# EAGLE design blast (EAGLE 6.5.0)
AUTHOR: Brad Campbell; REV: A; TITLE: Blast
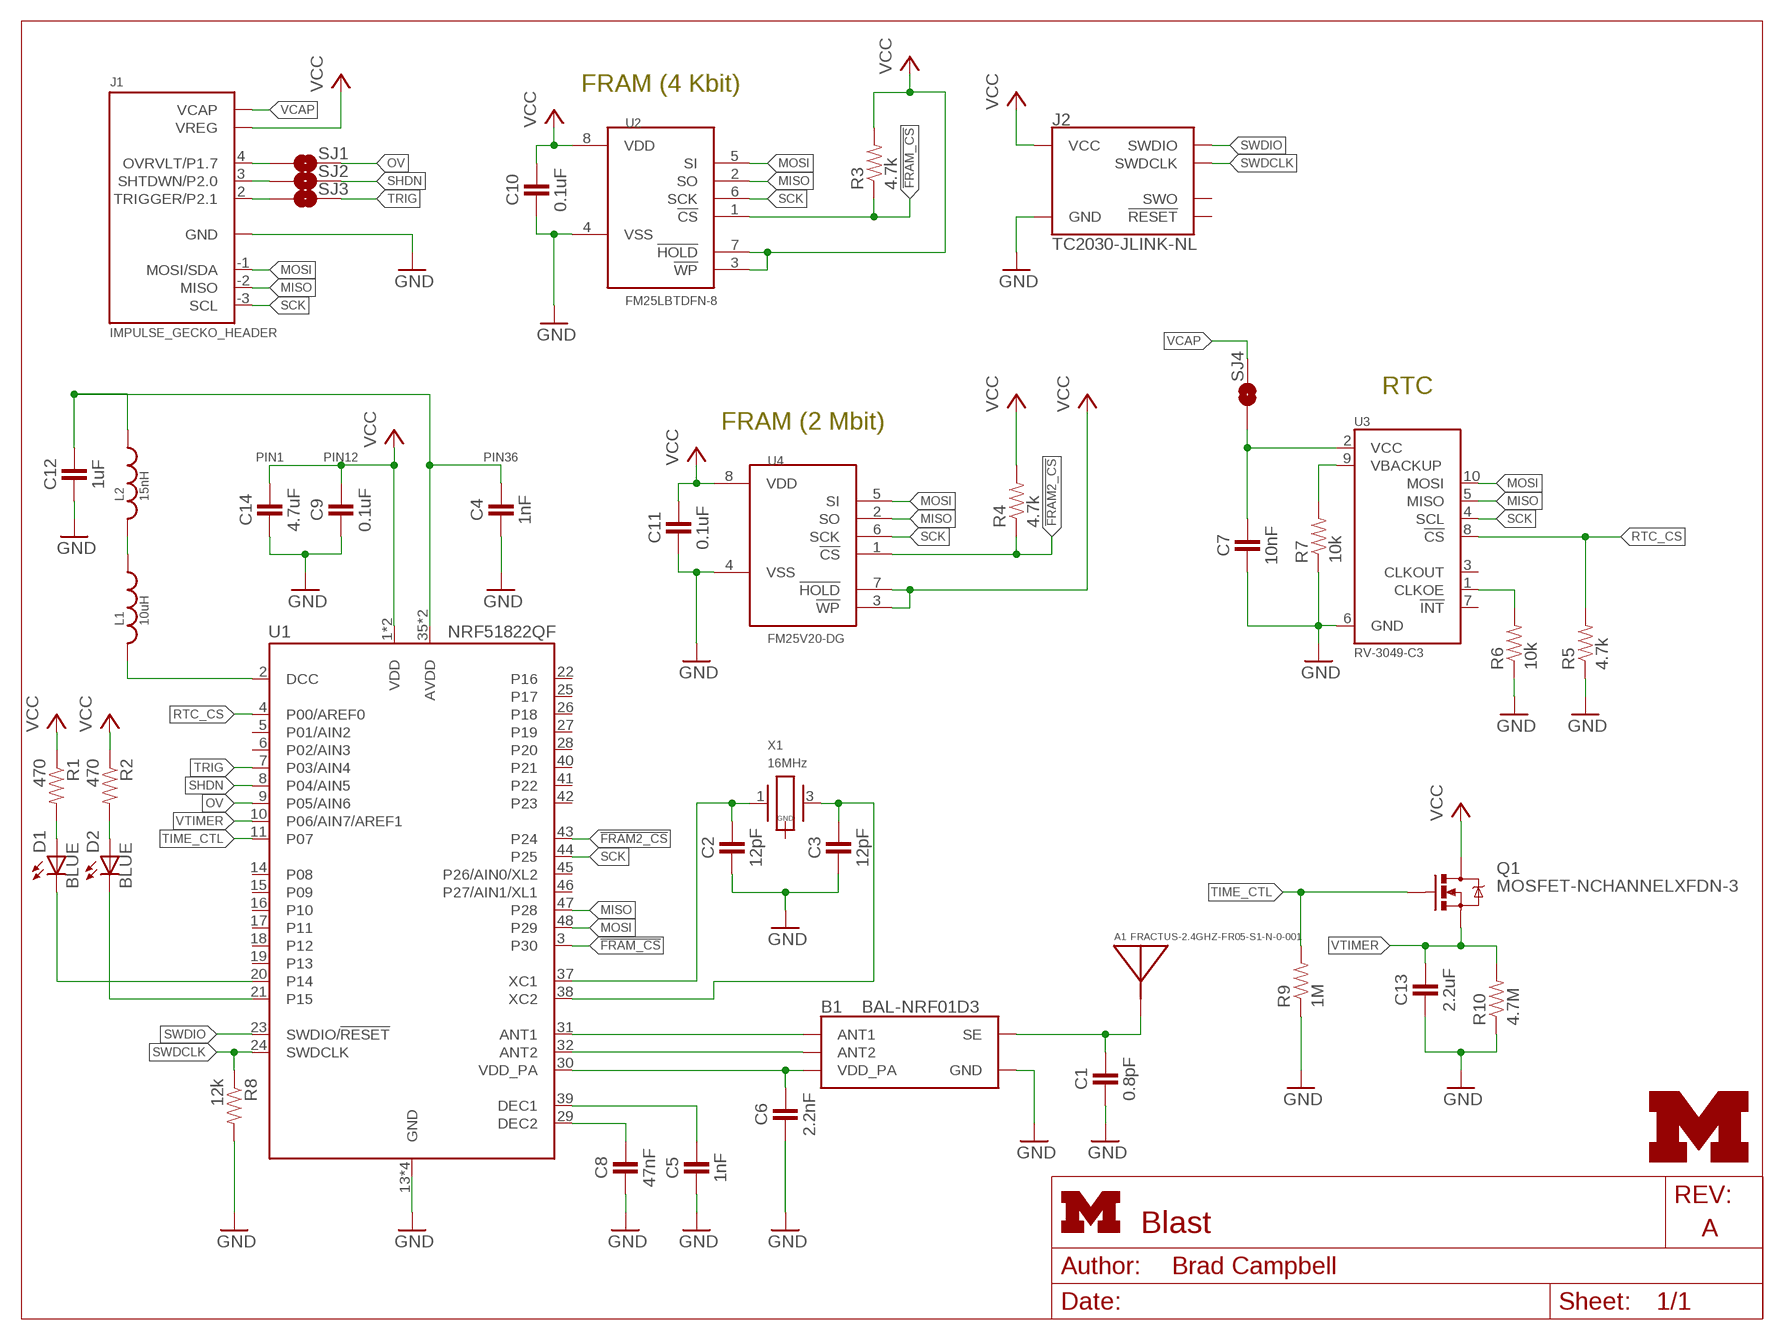
[diagram p0: schematic, sheet 1]
FRAME1 (LETTER_L): HEIGHT: 8.5in; WIDTH: 11in

## Parts
A1  FRACTUS-2.4GHZ-FR05-S1-N-0-001  [FRACTUS-ANTENNA-FR05-S1-N-0-001]
B1  BAL-NRF01D3  [BAL-NRF01D3]
C1  0.8pF  CAPACITOR  [0402_CAP]
C2  12pF  CAPACITOR  [0402_CAP]
C3  12pF  CAPACITOR  [0402_CAP]
C4  1nF  CAPACITOR  [0402_CAP]
C5  1nF  CAPACITOR  [0402_CAP]
C6  2.2nF  CAPACITOR  [0402_CAP]
C7  10nF  CAPACITOR  [0402_CAP]
C8  47nF  CAPACITOR  [0402_CAP]
C9  0.1uF  CAPACITOR  [0402_CAP]
C10  0.1uF  CAPACITOR  [0402_CAP]
C11  0.1uF  CAPACITOR  [0402_CAP]
C12  1uF  CAPACITOR  [0402_CAP]
C13  2.2uF  CAPACITOR  [0402_CAP]
C14  4.7uF  CAPACITOR  [0402_CAP]
D1  BLUE  LED0603  [LED-0603]
D2  BLUE  LED0603  [LED-0603]
J1  IMPULSE_GECKO_HEADER  [HEADER1X9/0.05IN]
J2  TC2030-JLINK-NL  [TC2030-IDC-NL]
L1  10uH  INDUCTOR0603  [0603_CAP]
L2  15nH  INDUCTOR0402  [0402_CAP]
Q1  MOSFET-NCHANNELXFDN-3  [XFDFN-3]
R1  470  RESISTOR  [0402_RES]
R2  470  RESISTOR  [0402_RES]
R3  4.7k  RESISTOR  [0402_RES]
R4  4.7k  RESISTOR  [0402_RES]
R5  4.7k  RESISTOR  [0402_RES]
R6  10k  RESISTOR  [0402_RES]
R7  10k  RESISTOR  [0402_RES]
R8  12k  RESISTOR  [0402_RES]
R9  1M  RESISTOR  [0402_RES]
R10  4.7M  RESISTOR  [0402_RES]
SJ1  SOLDERJUMPERNO  [SJ_2S-NO]
SJ2  SOLDERJUMPERNO  [SJ_2S-NO]
SJ3  SOLDERJUMPERNO  [SJ_2S-NO]
SJ4  SOLDERJUMPERNO  [SJ_2S-NO]
U1  NRF51822QF  [QFN-48-6MM]
U2  FM25LBTDFN-8  [TDFN-8@1]
U3  RV-3049-C3  [MICRO-CRYSTAL-C3]
U4  FM25V20-DG  [TDFN-8/6MM]
U$1  UMICH_SOLID_SMALL  [UMICH_SOLID_75MIL]
X1  16MHz  TXC-8Y  [TXC-8Y]

## Nets
!FRAM2_CS: R4.1 U1.43(P24) U4.1(!CS)
!FRAM_CS: R3.1 U1.3(P30) U2.1(!CS)
BATTERY: C7.1 SJ4.1 U3.2(VCC)
GND: B1.GND C1.2 C2.2 C3.2 C4.2 C5.2 C6.2 C7.2 C8.2 C9.2 C10.2 C11.2 C12.2 C13.2 C14.2 J1.0(GND) J2.5(GND) R5.1 R6.1 R7.1 R8.2 R9.1 R10.1 U1.13(GND) U1.33(GND) U1.34(GND) U1.GND U2.4(VSS) U3.6(GND) U4.4(VSS)
MISO: J1.-2(MISO) U1.47(P28) U2.2(SO) U3.5(MISO) U4.2(SO)
MOSI: J1.-1(MOSI/SDA) U1.48(P29) U2.5(SI) U3.10(MOSI) U4.5(SI)
N$1: D2.C U1.21(P15)
N$5: B1.ANT1 U1.31(ANT1)
N$6: B1.ANT2 U1.32(ANT2)
N$7: D1.C U1.20(P14)
N$8: R7.2 U3.9(VBACKUP)
N$9: R6.2 U3.1(CLKOE)
N$11: A1.1(ANTENNA) B1.SE C1.1
N$12: C4.1 C12.1 L2.1 U1.35(AVDD) U1.36(AVDD)
N$13: L1.2 U1.2(DCC)
N$14: L1.1 L2.2
N$15: D2.A R2.2
N$16: C2.1 U1.37(XC1) X1.1
N$17: C3.1 U1.38(XC2) X1.3
N$18: C5.1 U1.39(DEC1)
N$19: C8.1 U1.29(DEC2)
N$20: J1.2(TRIGGER/P2.1) SJ3.1
N$21: J1.3(SHTDWN/P2.0) SJ2.1
N$22: J1.4(OVRVLT/P1.7) SJ1.1
N$23: D1.A R1.2
OV: SJ1.2 U1.9(P05/AIN6)
RTC_CS: R5.2 U1.4(P00/AREF0) U3.8(!CS)
SCK: J1.-3(SCL) U1.44(P25) U2.6(SCK) U3.4(SCL) U4.6(SCK)
SHDN: SJ2.2 U1.8(P04/AIN5)
SWDCLK: J2.4(SWDCLK) R8.1 U1.24(SWDCLK)
SWDIO: J2.2(SWDIO) U1.23(SWDIO/!RESET)
TIME_CTL: Q1.G R9.2 U1.11(P07)
TRIG: SJ3.2 U1.7(P03/AIN4)
VCAP: J1.5(VCAP) SJ4.2
VCC: C9.1 C10.1 C11.1 C14.1 J1.1(VREG) J2.1(VCC) Q1.D R1.1 R2.1 R3.2 R4.2 U1.1(VDD) U1.12(VDD) U2.3(!WP) U2.7(!HOLD) U2.8(VDD) U4.3(!WP) U4.7(!HOLD) U4.8(VDD)
VDD_PA: B1.VCC(VDD_PA) C6.1 U1.30(VDD_PA)
VTIMER: C13.1 Q1.S R10.2 U1.10(P06/AIN7/AREF1)
Unconnected: J2.3(!RESET) J2.6(SWO) U1.5(P01/AIN2) U1.6(P02/AIN3) U1.14(P08) U1.15(P09) U1.16(P10) U1.17(P11) U1.18(P12) U1.19(P13) U1.22(P16) U1.25(P17) U1.26(P18) U1.27(P19) U1.28(P20) U1.40(P21) U1.41(P22) U1.42(P23) U1.45(P26/AIN0/XL2) U1.46(P27/AIN1/XL1) U3.3(CLKOUT) U3.7(!INT) X1.2(GND) X1.4(GND)

## Notes on the sheet
- FRAM (4 Kbit)
- RTC
- FRAM (2 Mbit)
- PIN1 | PIN12 | PIN36

## Library data of the parts
A1 = chips:FRACTUS-2.4GHZ-FR05-S1-N-0-001: Fractus Reach Xtend Bluetooth®, Zigbee®, 802.11 b/g/n WLAN Chip Antenna; RICHARDSON_RFPD: FR05-S1-N-0001B
B1 = chips:BAL-NRF01D3: 50 ohm nominal input / conjugate match balun to nRF51422-QFAA, nRF24LE1, nRF51822-QFAA/AB, with integrated harmonic filter; DIGIKEY: 497-13637-1-ND; MOUSER: 511-BAL-NRF01D3
C1 = passives:CAPACITOR: 0402 Capacitor; DIGIKEY: 490-6269-1-ND
C2 C3 = passives:CAPACITOR: 0402 Capacitor; DIGIKEY: 490-6197-1-ND
C4 C5 = passives:CAPACITOR: 0402 Capacitor; DIGIKEY: 490-1303-1-ND
C6 = passives:CAPACITOR: 0402 Capacitor; DIGIKEY: 490-5419-1-ND
C7 = passives:CAPACITOR: 0402 Capacitor; DIGIKEY: 445-1260-1-ND
C8 = passives:CAPACITOR: 0402 Capacitor; DIGIKEY: 445-1264-1-ND
C9-C11 = passives:CAPACITOR: 0402 Capacitor; DIGIKEY: 445-4952-1-ND
C12 = passives:CAPACITOR: 0402 Capacitor; DIGIKEY: 1276-1513-1-ND
C13 = passives:CAPACITOR: 0402 Capacitor; DIGIKEY: 445-3882-1-ND
C14 = passives:CAPACITOR: 0402 Capacitor; DIGIKEY: 445-5947-1-ND
D1 D2 = SparkFun-LED:LED: LEDs Standard schematic elements and footprints for 5mm, 3mm, 1206, and 0603 sized LEDs. 5mm - Spark Fun Electronics SKU : COM-00529 (and others); DIGIKEY: 160-1837-1-ND
J1 = gecko:IMPULSE_GECKO_HEADER: Header on the impulse EPIC-esque board.
J2 = connector:TC2030-JLINK
L1 = passives:INDUCTOR; DIGIKEY: 490-4025-1-ND
L2 = passives:INDUCTOR; DIGIKEY: 587-1521-1-ND
Q1 = fets:MOSFET-NCHANNEL: Generic NMOS footprint; DIGIKEY: DMN2400UFB4-7DICT-ND
R1 R2 = passives:RESISTOR: Resistor Basic schematic elements and footprints for 0603, 1206, and PTH resistors.; DIGIKEY: RHM470CECT-ND
R3-R5 = passives:RESISTOR: Resistor Basic schematic elements and footprints for 0603, 1206, and PTH resistors.; DIGIKEY: RHM4.7KCECT-ND
R6 R7 = passives:RESISTOR: Resistor Basic schematic elements and footprints for 0603, 1206, and PTH resistors.; DIGIKEY: RHM10KCECT-ND
R8 = passives:RESISTOR: Resistor Basic schematic elements and footprints for 0603, 1206, and PTH resistors.; DIGIKEY: RHM12.0KCDCT-ND
R9 = passives:RESISTOR: Resistor Basic schematic elements and footprints for 0603, 1206, and PTH resistors.; DIGIKEY: RHM1.0MCECT-ND
R10 = passives:RESISTOR: Resistor Basic schematic elements and footprints for 0603, 1206, and PTH resistors.; DIGIKEY: 541-4.7MJCT-ND
SJ1-SJ4 = SparkFun-Passives:SOLDERJUMPER: Solder Jumper Standard SMD solder jumper. Used to automate production. Two varients : Normally Open and Normally Closed are the same, but have different paste layers. NC will have a large amount of paste and should jumper during reflow.
U1 = chips:NRF51822: Multiprotocol Bluetooth® 4.0 low energy/2.4 GHz RF SoC; DIGIKEY: 1490-1042-1-ND; MOUSER: 949-NRF51822-QFAC-R7
U2 = chips:FM25LB: IC FRAM 4KBIT 10MHZ 8SOIC; DIGIKEY: FM25L04B-DGRA-ND; MOUSER: 877-FM25L04B-DG
U3 = chips:RV-3049-C3: The RV-3049-C3 is an ultra miniature Real-Time-Clock Module with embedded Crystal. This RTC has an SPI Bus (4-wire Serial- Interface) and offers temperature compensated time.; NEWARK: RV-3049-C3
U4 = chips:FM25: Cypress FRAM; DIGIKEY: FM25V20-DGRA-ND; MOUSER: 877-FM25V20-DG
U$1 = logos:UMICH_SOLID
X1 = crystals:TXC-8Y: 2mmx1.6mm SMD Crystal; DIGIKEY: 887-2003-1-ND

## Board
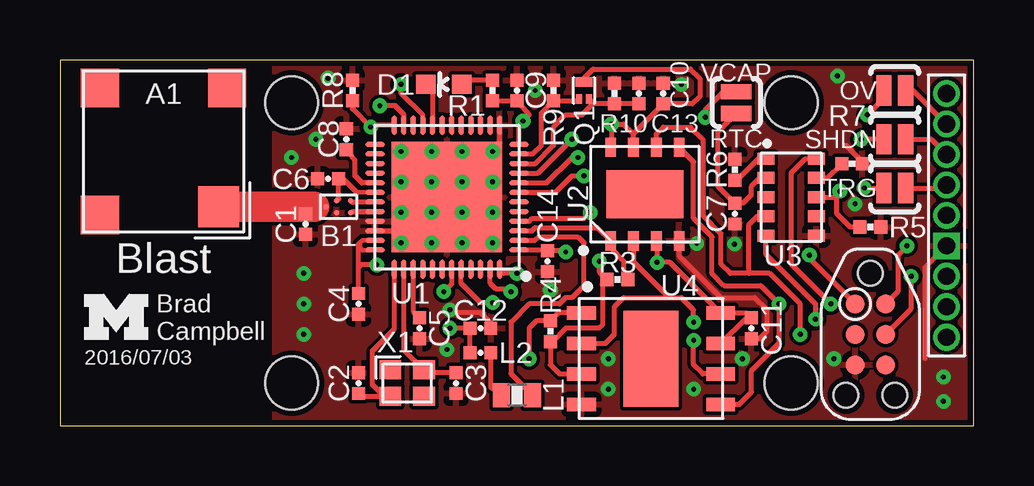
[diagram p1: board, top side]
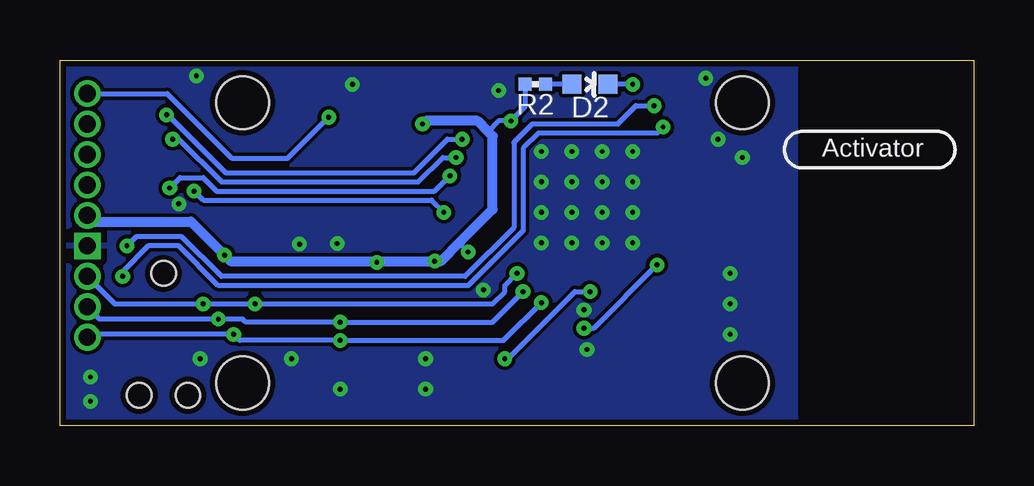
[diagram p2: board, bottom side, seen from below]

Size 38.1 x 15.24 mm. Coordinates in mm from the lower left corner, seen from the top.
Outline: 0,0 38.1,0 38.1,15.24 0,15.24 0,0
Copper layers (1*16): Top 0.0178mm / dielectric 59mil / Bottom 0.0178mm
Design rules "sunstone-2lyr_v1.0.0.3 *": minimum track width 6mil, minimum drill 8mil, track to track 6mil, track to pad 6mil, pad to pad 6mil, via to via 6mil, smd to smd 6mil, copper to edge 10mil, drill to drill 16mil, minimum pad ring 8mil, minimum via ring 8mil, stop-mask expansion 3mil, vias tented up to drill 50mil, thermal gap 10mil
Holes 2.2 mm at 9.65,13.46 30.48,1.78 9.65,1.78 30.48,13.46

### Footprints (pad centres in the part's own frame; a part is rotated, then mirrored left to right if it is on the bottom)
FRACTUS-ANTENNA-FR05-S1-N-0-001 = smd 1.7 x 1.7: 1 2.3,-2.3 | smd 1.6 x 1.6: 2 2.65,2.65; 3 -2.65,-2.65; 4 -2.65,2.65
BAL-NRF01D3 = smd 0.22 x 0.22: ANT1 -0.517,-0.25; ANT2 -0.517,0.25; GND 0.083,0.25; SE 0.516,0; VCC 0.083,-0.25
0402_CAP = smd 0.536 x 0.546: 1 -0.433,0; 2 0.433,0
LED-0603 = smd 0.8 x 0.8: A 0,-0.75; C 0,0.75
HEADER1X9/0.05IN = drill 0.711 pad 1.016 square: 0 -1.27,0 | drill 0.711 pad 1.016: 1 0,0; 2 1.27,0; 3 2.54,0; 4 3.81,0; 5 5.08,0; -1 -2.54,0; -2 -3.81,0; -3 -5.08,0
TC2030-IDC-NL = smd 0.787 x 0.787: 1 -1.27,-0.635; 2 -1.27,0.635; 3 0,-0.635; 4 0,0.635; 5 1.27,-0.635; 6 1.27,0.635 | hole 1.016: -2.54,0; 2.54,1.016; 2.54,-1.016
0603_CAP = smd 0.7 x 1: 1 -0.65,0; 2 0.65,0
XFDFN-3 = smd 0.4 x 0.7: D 0.35,0 | smd 0.4 x 0.25: G -0.35,0.215; S -0.35,-0.215
0402_RES = smd 0.536 x 0.546: 1 -0.433,0; 2 0.433,0
SJ_2S-NO = smd 0.635 x 1.27: 1 -0.45,0; 2 0.45,0
QFN-48-6MM = smd 0.8 x 0.203: 1 -3,2.2; 2 -3,1.8; 3 -3,1.4; 4 -3,1; 5 -3,0.6; 6 -3,0.2; 7 -3,-0.2; 8 -3,-0.6; 9 -3,-1; 10 -3,-1.4; 11 -3,-1.8; 12 -3,-2.2; 25 3,-2.2; 26 3,-1.8; 27 3,-1.4; 28 3,-1; 29 3,-0.6; 30 3,-0.2; 31 3,0.2; 32 3,0.6; 33 3,1; 34 3,1.4; 35 3,1.8; 36 3,2.2 | smd 0.203 x 0.8: 13 -2.2,-3; 14 -1.8,-3; 15 -1.4,-3; 16 -1,-3; 17 -0.6,-3; 18 -0.2,-3; 19 0.2,-3; 20 0.6,-3; 21 1,-3; 22 1.4,-3; 23 1.8,-3; 24 2.2,-3; 37 2.2,3; 38 1.8,3; 39 1.4,3; 40 1,3; 41 0.6,3; 42 0.2,3; 43 -0.2,3; 44 -0.6,3; 45 -1,3; 46 -1.4,3; 47 -1.8,3; 48 -2.2,3 | smd 4.6 x 4.6: GND 0,0
TDFN-8@1 = smd 0.45 x 0.8: 1 -1.425,-1.95; 2 -0.475,-1.95; 3 0.475,-1.95; 4 1.425,-1.95; 5 1.425,1.95; 6 0.475,1.95; 7 -0.475,1.95; 8 -1.425,1.95 | smd 3.2 x 2: NC 0,0
MICRO-CRYSTAL-C3 = smd 0.5 x 0.7: 1 -1.6,-1.05; 2 -0.8,-1.05; 3 0,-1.05; 4 0.8,-1.05; 5 1.6,-1.05; 6 1.6,1.05; 7 0.8,1.05; 8 0,1.05; 9 -0.8,1.05; 10 -1.6,1.05
TDFN-8/6MM = smd 0.55 x 1.2: 1 -1.905,-2.9; 2 -0.635,-2.9; 3 0.635,-2.9; 4 1.905,-2.9; 5 1.905,2.9; 6 0.635,2.9; 7 -0.635,2.9; 8 -1.905,2.9 | smd 4 x 2.3: NC 0,0
TXC-8Y = smd 0.9 x 0.8: 1 -0.7,-0.55; 2 0.7,-0.55; 3 0.7,0.55; 4 -0.7,0.55

### Placement (x,y rotation side)
A1  4.32,11.43 0 top
B1  11.61,9.12 180 top
C1  10.24,8.41 270 top
C2  12.45,1.78 90 top
C3  16.51,1.78 270 top
C4  12.45,5.08 270 top
C5  14.99,4.06 270 top
C6  11.18,10.29 180 top
C7  28.14,8.84 270 top
C8  11.94,11.94 90 top
C9  19.05,13.97 90 top
C10  25.15,13.84 90 top
C11  28.83,4.06 270 top
C12  17.53,4.06 0 top
C13  24.13,13.84 90 top
C14  20.32,6.86 270 top
D1  16,14.22 90 top
D2  16,14.22 270 bottom
J1  36.96,8.76 90 top
J2  33.78,3.81 270 top
L1  19.05,1.27 0 top
L2  17.53,3.05 0 top
Q1  21.84,13.97 90 top
R1  18.03,13.97 90 top
R2  18.29,14.22 0 bottom
R3  23.24,6.1 180 top
R4  20.45,3.94 270 top
R5  33.78,8.28 180 top
R6  28.14,10.67 270 top
R7  33.02,10.92 180 top
R8  12.19,13.97 90 top
R9  20.57,13.97 270 top
R10  23.11,13.84 270 top
SJ1  34.8,13.97 180 top
SJ2  34.8,11.94 180 top
SJ3  34.8,9.91 180 top
SJ4  28.19,13.46 90 top
U1  16.13,9.53 180 top
U2  24.38,9.65 0 top
U3  30.48,9.53 270 top
U4  24.64,2.79 270 top
U$1  1.02,3.58 0 top
X1  14.48,1.78 0 top

### Tracks (layer width: path | path; a pad name or v marks a point on that pad's centre or on a via)
!FRAM2_CS  (via drill 0.2)
  Top 0.203: U4.1 20.78,4.7 R4.1 19.86,4.37 19.56,4.06 v19.56,2.79 | U1.43 16.33,5.92 v16,5.59
  Bottom 0.203: v19.56,2.79 19.43,2.79 16.64,5.59 v16,5.59
!FRAM_CS
  Top 0.203: U1.3 19.68,8.12 19.81,8.26 22.41,8.26 U2.1 22.96,7.39 23.5,6.86 23.5,6.28 R3.1
BATTERY
  Top 0.203: U3.2 29.17,10.32 28.8,9.96 28.8,9.6 28.48,9.27 C7.1 27.41,10.01 27.41,12.22 SJ4.1
GND  (via drill 0.2)
  Top 0.203: 17.65,10.97 18.33,11.65 18.33,11.68 | U1.GND 16.54,9.96 16.64,9.96 16.64,10.03 v16.76,10.16 | U1.34 14.16,8.12 14.16,7.69 v14.22,7.62 | U1.13 18.33,11.68 | C12.2 17.96,4.27 17.53,4.7 16.38,4.7 v16.26,4.83 | U2.4 25.81,7.08 27.56,5.33 28.96,5.33 29.46,4.83 29.46,3.94 29.16,3.63 C11.2 | 36.07,2.79 36.07,6.6 J1.0 | v18.03,11.43 18.29,11.68 18.33,11.68 | R7.1 33.45,11 32.77,11.68
  other vias: 10.16,5.08 10.16,3.81 9.65,11.18 15.49,10.16 10.16,6.35 10.67,11.94 11.18,14.48 15.49,8.89 16.76,8.89 14.22,10.16 14.22,11.43 15.49,11.43 16.76,11.43 18.03,10.16 18.03,8.89 18.03,7.62 16.76,7.62 15.49,7.62 14.22,8.89 25.91,14.22 19.81,13.97 16.13,3.17 28.45,2.79 32.26,2.79 36.83,2.03 36.83,1.02 26.42,1.52 22.86,1.52 22.86,2.79 28.12,7.57 33.15,9.25 20.45,5.66 26.54,7.59 32.41,14.58
  pour Top: 8.94,16 38.61,16 38.61,-0.51 8.94,-0.51
  pour Bottom: 7.42,16 38.61,16 38.61,-0.51 7.42,-0.51
MISO  (via drill 0.2)
  Top 0.203: U1.47 17.93,5.95 18.16,5.71 18.67,5.71 v18.8,5.59 | U2.2 23.91,6.83 25.4,5.33 | 25.4,5.33 25.91,5.33 26.42,4.83 v26.42,4.32 | v31.5,4.45 31.5,5.08 29.43,7.15 U3.5 | U4.2 22.73,3.43 23.11,3.81 23.11,4.95 23.5,5.33 25.4,5.33
  Bottom 0.203: v18.8,5.59 20.07,4.32 v26.42,4.32 30.35,4.32 30.48,4.45 v31.5,4.45 36.45,4.45 J1.-2
MOSI  (via drill 0.2)
  Top 0.203: v19.05,6.35 18.5,6.35 U1.48 | U2.5 26.42,10.99 26.42,8.64 27.18,7.87 27.18,6.35 27.69,5.84 29.21,5.84 v29.97,5.08 29.97,3.43 28.83,2.29 28.83,1.4 28.32,0.89 U4.5 | v32.13,5.08 30.48,6.73 30.48,10.54 31.06,11.12 U3.10
  Bottom 0.203: J1.-1 35.81,5.08 v32.13,5.08 v29.97,5.08 20.07,5.08 19.56,5.59 19.56,5.84 v19.05,6.35
N$1  (via drill 0.2)
  Top 0.203: U1.21 15.13,12.94 14.22,13.84 v14.22,14.22
  Bottom 0.203: v14.22,14.22 D2.C
N$5
  Top 0.22: B1.ANT1 12.2,9.32 U1.31
N$6
  Top 0.22: B1.ANT2 12.2,8.92 U1.32
N$7
  Top 0.203: D1.C 15.53,13.95 U1.20
N$8
  Top 0.203: U3.9 31.99,10.32 R7.2
N$9
  Top 0.203: U3.1 29.11,11.12 28.22,10.23 R6.2
N$11
  Top 0.203: B1.SE 10.59,9.12 10.56,9.12 C1.1
  Top 1.27: 10.59,9.12 6.62,9.12 A1.1
N$12  (via drill 0.2)
  Top 0.203: U1.35 12.6,7.72 12.5,7.62 | 12.5,7.62 12.5,7.42 12.6,7.32 U1.36 | L2.1 C12.1 v16.26,4.06 | C4.1 12.45,6.6 | 12.45,6.6 12.45,7.57 12.5,7.62 | v13.21,6.71 12.55,6.71 12.45,6.6
  Bottom 0.203: v16.26,4.06 15.85,4.06 v13.21,6.71
N$13
  Top 0.203: U1.2 19.79,7.72 19.94,7.87 21.59,7.87 21.84,7.62 21.84,5.84 21.34,5.33 21.08,5.33 20.83,5.08 19.56,5.08 18.8,4.32 18.8,2.17 L1.2
N$14
  Top 0.203: L1.1 17.96,1.59 L2.2
N$15
  Bottom 0.203: D2.A R2.2
N$16
  Top 0.203: C2.1 12.56,1.23 X1.1 13.5,1.23 13.03,1.7 13.03,3.12 13.93,4.02 U1.37
N$17
  Top 0.203: C3.1 15.29,2.21 X1.3 14.33,3.18 U1.38
N$18
  Top 0.203: U1.39 14.73,4.75 C5.1
N$19
  Top 0.203: U1.29 12.59,10.12 12.29,10.41 12.29,11.07 C8.1
N$20
  Top 0.203: SJ3.1 36.83,9.91 J1.2
N$21
  Top 0.203: SJ2.1 36.32,11.94 J1.3
N$22
  Top 0.203: SJ1.1 35.56,13.97 J1.4
N$23
  Top 0.203: R1.2 16.93,14.4 D1.A
OV  (via drill 0.2)
  Top 0.203: U1.9 19.92,10.53 v21.34,11.94 | SJ1.2 34.35,13.65 v33.66,12.95
  Bottom 0.203: v33.66,12.95 33.6,12.95 31.19,10.54 23.34,10.54 21.95,11.94 v21.34,11.94
RTC_CS  (via drill 0.2)
  Top 0.203: U1.4 19.57,8.53 19.68,8.64 21.84,8.64 v22.1,8.89 | R5.2 32.94,8.28 32.38,8.84 32.38,9.65 v32.51,9.78 32.26,9.53 U3.8
  Bottom 0.203: v22.1,8.89 22.61,9.4 32.13,9.4 v32.51,9.78
SCK  (via drill 0.2)
  Top 0.203: v18.03,5.13 17.53,5.13 16.73,5.93 U1.44 | U2.6 24.86,12.16 25.15,12.45 26.29,12.45 26.8,11.94 26.8,8.76 27.56,8 27.56,6.73 27.94,6.35 28.73,6.35 | v30.86,3.81 30.86,5.08 29.59,6.35 28.73,6.35 | U4.6 26.8,2.16 26.42,2.54 v26.42,3.56 | 28.73,6.35 28.7,6.38 28.7,8.36 29.07,8.72 U3.4
  Bottom 0.203: v18.03,5.13 19.61,3.56 v26.42,3.56 30.61,3.56 v30.86,3.81 36.83,3.81 J1.-3
SHDN  (via drill 0.2)
  Top 0.203: U1.8 20.29,10.12 21.34,11.18 v21.59,11.18 | SJ2.2 v33.4,11.94
  Bottom 0.203: v21.59,11.18 22.15,11.18 23.16,10.16 31.37,10.16 33.15,11.94 v33.4,11.94
SWDCLK  (via drill 0.2)
  Top 0.203: R8.1 12.19,13.21 v12.95,12.45 13.03,12.53 U1.24 | J2.4 35.48,4.88 v35.48,6.22
  Bottom 0.203: v12.95,12.45 13.21,12.19 18.16,12.19 18.8,11.56 18.8,8.13 21.08,5.84 31.5,5.84 33.15,7.49 34.42,7.49 35.48,6.43 v35.48,6.22
SWDIO  (via drill 0.2)
  Top 0.203: v35.31,7.49 34.92,7.11 34.92,5.59 J2.2 | U1.23 14.33,12.98 13.97,13.34 v13.34,13.34
  Bottom 0.203: v35.31,7.49 34.92,7.87 33.02,7.87 31.37,6.22 21.21,6.22 19.18,8.26 19.18,11.81 18.41,12.57 14.86,12.57 14.1,13.34 v13.34,13.34
TIME_CTL
  Top 0.203: U1.11 19.71,11.32 20.07,11.68 20.07,13.03 R9.2 21.55,13.54 Q1.G
TRIG  (via drill 0.2)
  Top 0.203: U1.7 20.65,9.72 21.34,10.41 v21.84,10.41 | v33.53,9.91 SJ3.2
  Bottom 0.203: v33.53,9.91 33.1,10.34 32.13,10.34 31.57,9.78 22.48,9.78 v21.84,10.41
VCAP  (via drill 0.2)
  Top 0.203: v26.9,12.85 26.9,13.16 27.65,13.91 SJ4.2
  Bottom 0.203: J1.5 33.63,13.84 30.94,11.15 28.6,11.15 v26.9,12.85
VCC  (via drill 0.2)
  Top 0.203: U1.1 20.29,7.33 C14.1 21.03,7.29 v21.08,7.24 | v22.48,6.86 22.48,6.42 R3.2 22.61,5.89 22.61,4.19 22.48,4.06 21.08,4.06 20.52,3.5 R4.2 20.45,2.54 20.83,2.16 U4.3 | U1.12 19.13,12.53 v19.3,12.7 19.56,12.95 C9.1 R1.1 | U2.8 22.99,11.63 v22.99,12.57 23.5,12.57 23.9,12.17 23.91,12.17 | Q1.D 21.84,14.48 22.23,14.86 26.29,14.86 26.67,14.48 26.67,13.72 26.36,13.41 C10.1 23.91,12.17 | U2.7 23.91,12.17 | U4.7 27.56,3.43 28.63,4.5 C11.1 28.63,4.7 U4.8 25.43,6.81 v24.89,6.81 24.89,7.67 U2.3 | J2.1 31.24,6.99 v31.24,7.11
  Bottom 0.203: v21.08,7.24 21.4,7.56 21.4,7.68 | 20.26,12.26 19.81,12.7 v19.3,12.7 18.72,13.28 R2.1 | v24.89,6.81 24.84,6.86 v22.48,6.86
  Bottom 0.406: J1.1 36.7,8.51 32.64,8.51 v31.24,7.11 30.99,6.86 v22.48,6.86 22.23,6.86 21.4,7.68 20.07,9.02 20.07,12.06 20.26,12.26 20.7,12.7 22.86,12.7 v22.99,12.57
VDD_PA
  Top 0.203: U1.30 12.38,9.72 11.77,10.33 C6.1 11.62,9.45 B1.VCC
VTIMER
  Top 0.203: 22.23,13.41 R10.2 C13.1 | 22.23,13.41 22.14,13.54 Q1.S | U1.10 19.82,10.93 20.57,11.68 20.57,12.45 21.08,12.95 21.77,12.95 22.23,13.41

### Text on the board
tPlace: VCAP | OV | RTC | SHDN | TRG | Blast | Brad / Campbell | 2016/07/03
bPlace: Activator